# Altium schematic sheet UD3.1 N+P Gate Driver.SchDoc
size A3; DocumentNumber: 6; SheetNumber: 6; SheetTotal: 7
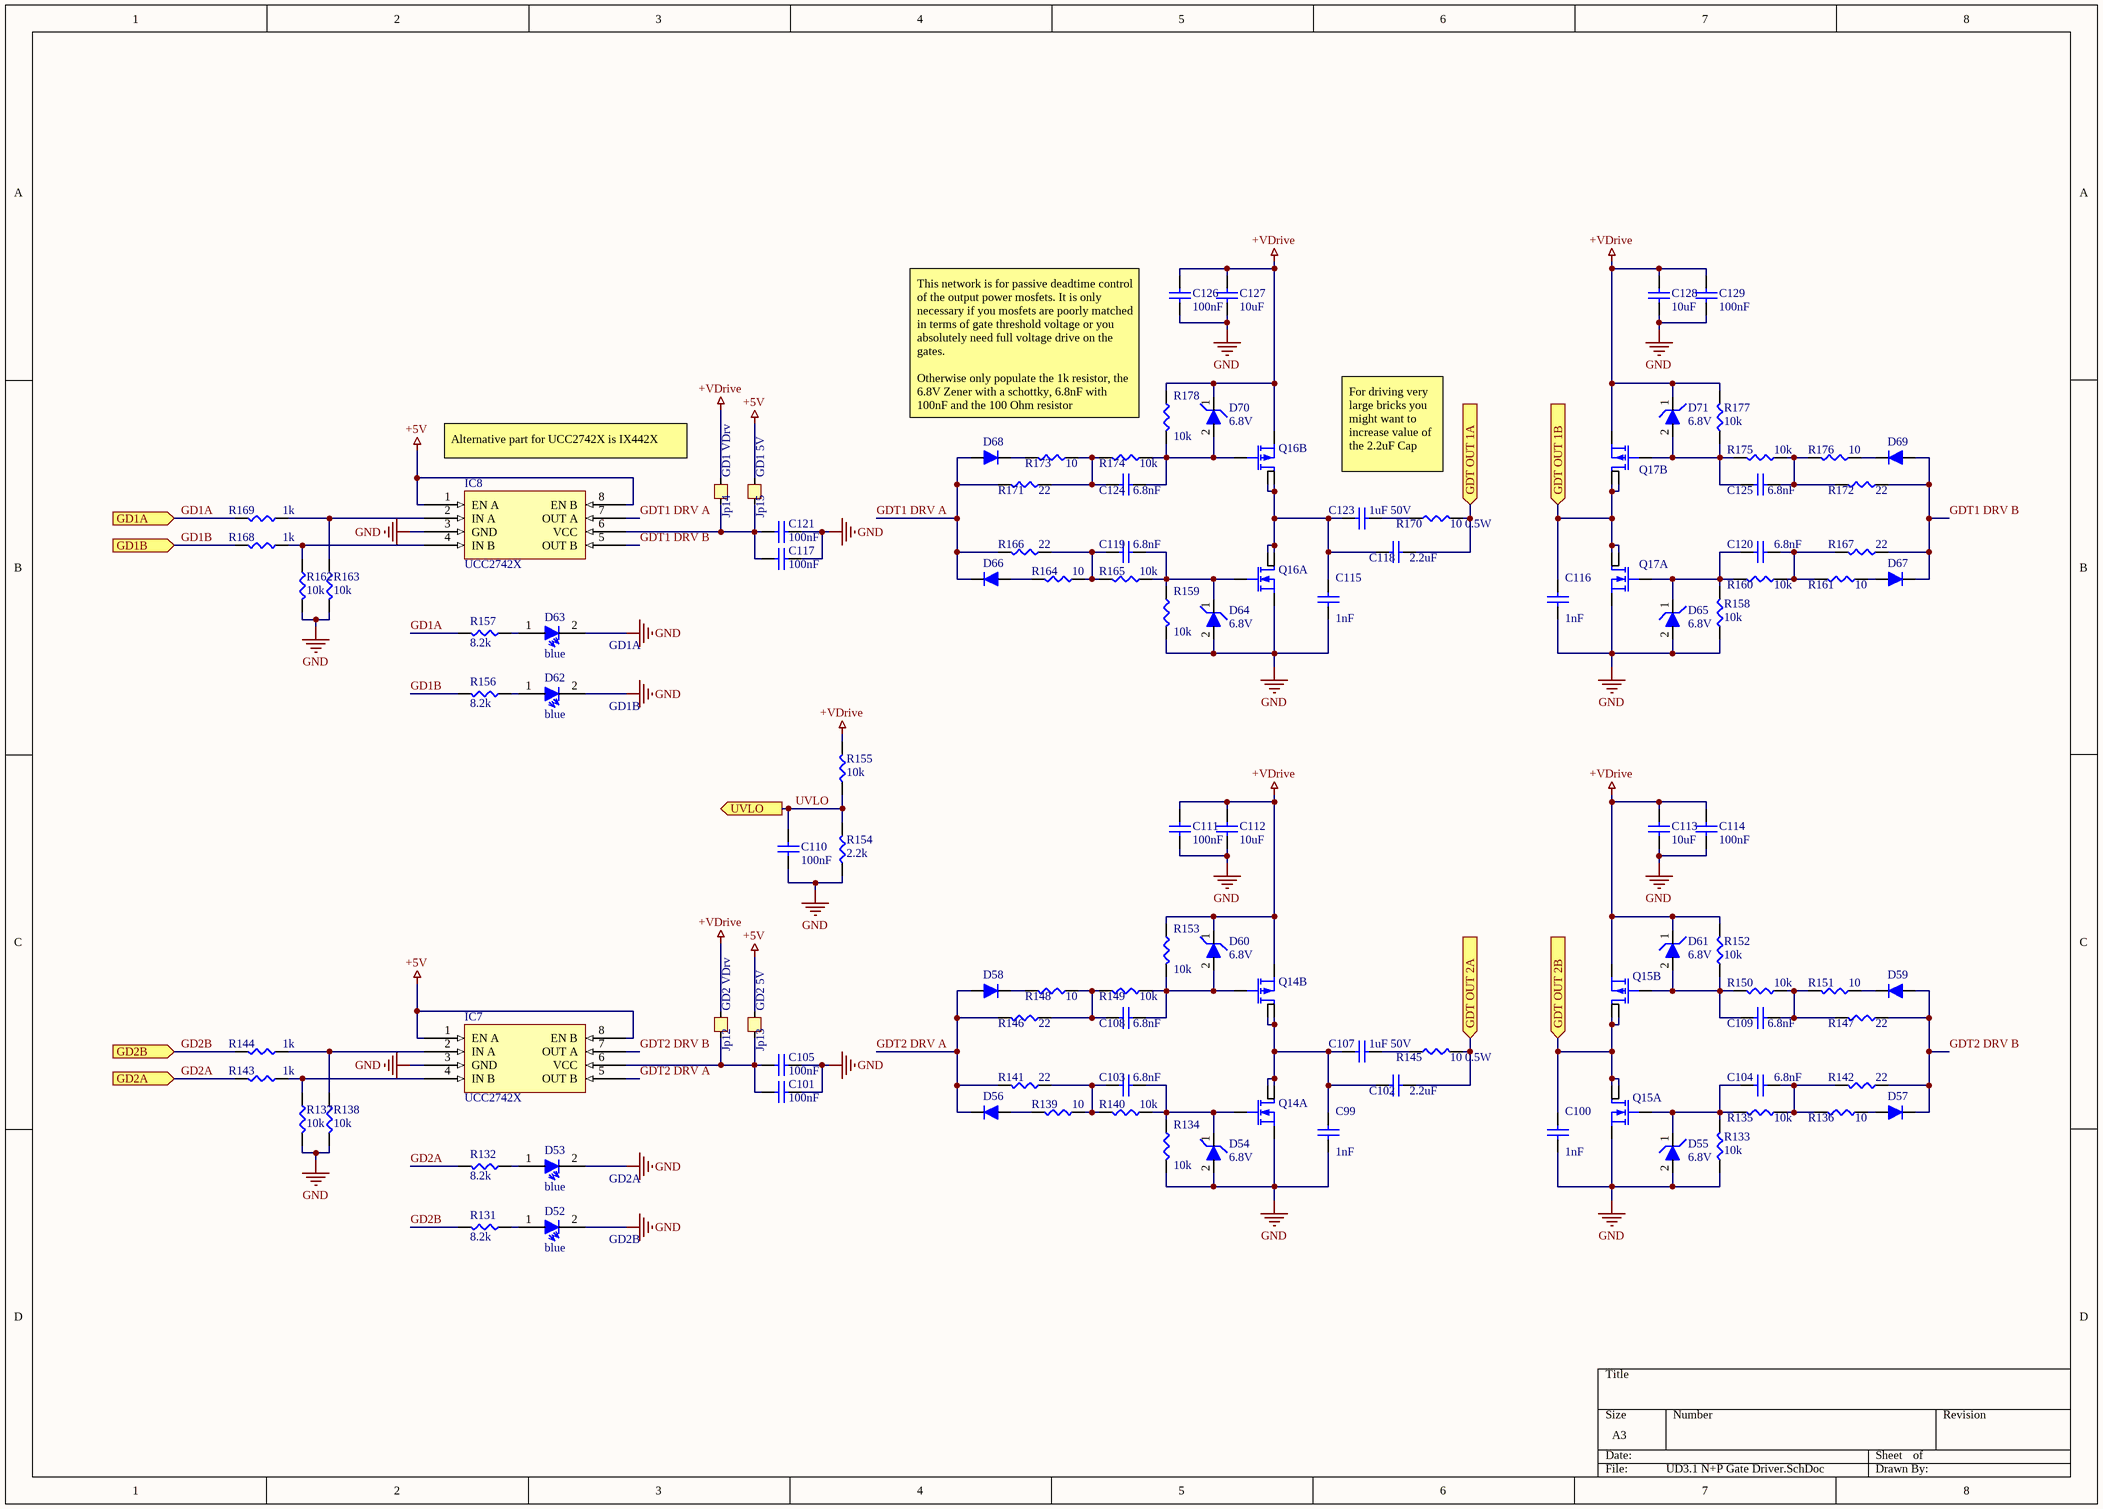
[diagram p0: UD3.1 N+P Gate Driver.SchDoc]

## Parts
C99  1nF  [0603]
C100  1nF  [0603]
C101  100nF  [0603]
C102  2.2uF  [1210]
C103  6.8nF  [0603]
C104  6.8nF  [0603]
C105  100nF  [0603]
C107  1uF 50V  [1210]
C108  6.8nF  [0603]
C109  6.8nF  [0603]
C110  100nF  [0603]
C111  100nF  [0603]
C112  10uF  [0805]
C113  10uF  [0805]
C114  100nF  [0603]
C115  1nF  [0603]
C116  1nF  [0603]
C117  100nF  [0603]
C118  2.2uF  [1210]
C119  6.8nF  [0603]
C120  6.8nF  [0603]
C121  100nF  [0603]
C123  1uF 50V  [1210]
C124  6.8nF  [0603]
C125  6.8nF  [0603]
C126  100nF  [0603]
C127  10uF  [0805]
C128  10uF  [0805]
C129  100nF  [0603]
D52  blue  [1206 Reverse Mount]
D53  blue  [1206 Reverse Mount]
D54  6.8V  [SOD523]
D55  6.8V  [SOD523]
D56  Schottky 30V 100mA  [SOD523]  (value not drawn)
D57  Schottky 30V 100mA  [SOD523]  (value not drawn)
D58  Schottky 30V 100mA  [SOD523]  (value not drawn)
D59  Schottky 30V 100mA  [SOD523]  (value not drawn)
D60  6.8V  [SOD523]
D61  6.8V  [SOD523]
D62  blue  [1206 Reverse Mount]
D63  blue  [1206 Reverse Mount]
D64  6.8V  [SOD523]
D65  6.8V  [SOD523]
D66  Schottky 30V 100mA  [SOD523]  (value not drawn)
D67  Schottky 30V 100mA  [SOD523]  (value not drawn)
D68  Schottky 30V 100mA  [SOD523]  (value not drawn)
D69  Schottky 30V 100mA  [SOD523]  (value not drawn)
D70  6.8V  [SOD523]
D71  6.8V  [SOD523]
IC7  UCC2742X  [SOIC8]
IC8  UCC2742X  [SOIC8]
Jp12  GD2 VDrv  [PCB Jumper NO]
Jp13  GD2 5V  [PCB Jumper NO]
Jp14  GD1 VDrv  [PCB Jumper NO]
Jp15  GD1 5V  [PCB Jumper NO]
Q14  Mosfet 1N1P  [SO-8FL - Dual]  (value not drawn)  (parts A,B of 2)
Q15  Mosfet 1N1P  [SO-8FL - Dual]  (value not drawn)  (parts A,B of 2)
Q16  Mosfet 1N1P  [SO-8FL - Dual]  (value not drawn)  (parts A,B of 2)
Q17  Mosfet 1N1P  [SO-8FL - Dual]  (value not drawn)  (parts A,B of 2)
R131  8.2k  [0603]
R132  8.2k  [0603]
R133  10k  [0603]
R134  10k  [0603]
R135  10k  [0603]
R136  10  [0603]
R137  10k  [0603]
R138  10k  [0603]
R139  10  [0603]
R140  10k  [0603]
R141  22  [0603]
R142  22  [0603]
R143  1k  [0603]
R144  1k  [0603]
R145  10 0.5W  [1210]
R146  22  [0603]
R147  22  [0603]
R148  10  [0603]
R149  10k  [0603]
R150  10k  [0603]
R151  10  [0603]
R152  10k  [0603]
R153  10k  [0603]
R154  2.2k  [0603]
R155  10k  [0603]
R156  8.2k  [0603]
R157  8.2k  [0603]
R158  10k  [0603]
R159  10k  [0603]
R160  10k  [0603]
R161  10  [0603]
R162  10k  [0603]
R163  10k  [0603]
R164  10  [0603]
R165  10k  [0603]
R166  22  [0603]
R167  22  [0603]
R168  1k  [0603]
R169  1k  [0603]
R170  10 0.5W  [1210]
R171  22  [0603]
R172  22  [0603]
R173  10  [0603]
R174  10k  [0603]
R175  10k  [0603]
R176  10  [0603]
R177  10k  [0603]
R178  10k  [0603]

## Ports
GD1A (in), GD1B (in), GD2A (in), GD2B (in), GDT OUT 1A (in), GDT OUT 1B (in), GDT OUT 2A (in), GDT OUT 2B (in), UVLO (out)

## Nets
+5V: IC7.1(EN_A) IC7.8(EN_B) IC8.1(EN_A) IC8.8(EN_B) Jp13.2 Jp15.2
+VDrive: C111.2 C112.2 C113.2 C114.2 C126.2 C127.2 C128.2 C129.2 D60.1 D61.1 D70.1 D71.1 Jp12.2 Jp14.2 Q14.Sp Q15.Sp Q16.Sp Q17.Sp R152.2 R153.2 R155.1 R177.2 R178.2
GND: C99.1 C100.1 C101.2 C105.2 C110.1 C111.1 C112.1 C113.1 C114.1 C115.1 C116.1 C117.2 C121.2 C126.1 C127.1 C128.1 C129.1 D52.2 D53.2 D54.2 D55.2 D62.2 D63.2 D64.2 D65.2 IC7.3(GND) IC8.3(GND) Q14.Sn Q15.Sn Q16.Sn Q17.Sn R133.1 R134.1 R137.1 R138.1 R154.2 R158.1 R159.1 R162.1 R163.1
GD1A: R157.1 R169.1 ; port GD1A
GD1B: R156.1 R168.1 ; port GD1B
GD2A: R132.1 R143.1 ; port GD2A
GD2B: R131.1 R144.1 ; port GD2B
GDT1 DRV A: D66.2 D68.1 IC8.7(OUT_A) R166.1 R171.1
GDT1 DRV B: D67.2 D69.1 IC8.5(OUT_B) R167.1 R172.1
GDT2 DRV A: D56.2 D58.1 IC7.5(OUT_B) R141.1 R146.1
GDT2 DRV B: D57.2 D59.1 IC7.7(OUT_A) R142.1 R147.1
GDT OUT 1A: C118.2 R170.2 ; port GDT OUT 1A
GDT OUT 1B: C116.2 Q17.Dn1 Q17.Dn2 Q17.Dp1 Q17.Dp2 ; port GDT OUT 1B
GDT OUT 2A: C102.2 R145.2 ; port GDT OUT 2A
GDT OUT 2B: C100.2 Q15.Dn1 Q15.Dn2 Q15.Dp1 Q15.Dp2 ; port GDT OUT 2B
UVLO: C110.2 R154.1 R155.2 ; port UVLO
NetC99_2: C99.2 C102.1 C107.1 Q14.Dn1 Q14.Dn2 Q14.Dp1 Q14.Dp2
NetC101_1: C101.1 C105.1 IC7.6(VCC) Jp12.1 Jp13.1
NetC103_1: C103.1 R139.2 R140.1 R141.2
NetC103_2: C103.2 D54.1 Q14.Gn R134.2 R140.2
NetC104_1: C104.1 R135.1 R136.2 R142.2
NetC104_2: C104.2 D55.1 Q15.Gn R133.2 R135.2
NetC107_2: C107.2 R145.1
NetC108_1: C108.1 R146.2 R148.2 R149.1
NetC108_2: C108.2 D60.2 Q14.Gp R149.2 R153.1
NetC109_1: C109.1 R147.2 R150.1 R151.2
NetC109_2: C109.2 D61.2 Q15.Gp R150.2 R152.1
NetC115_2: C115.2 C118.1 C123.1 Q16.Dn1 Q16.Dn2 Q16.Dp1 Q16.Dp2
NetC117_1: C117.1 C121.1 IC8.6(VCC) Jp14.1 Jp15.1
NetC119_1: C119.1 R164.2 R165.1 R166.2
NetC119_2: C119.2 D64.1 Q16.Gn R159.2 R165.2
NetC120_1: C120.1 R160.1 R161.2 R167.2
NetC120_2: C120.2 D65.1 Q17.Gn R158.2 R160.2
NetC123_2: C123.2 R170.1
NetC124_1: C124.1 R171.2 R173.2 R174.1
NetC124_2: C124.2 D70.2 Q16.Gp R174.2 R178.1
NetC125_1: C125.1 R172.2 R175.1 R176.2
NetC125_2: C125.2 D71.2 Q17.Gp R175.2 R177.1
NetD52_1: D52.1 R131.2
NetD53_1: D53.1 R132.2
NetD56_1: D56.1 R139.1
NetD57_1: D57.1 R136.1
NetD58_2: D58.2 R148.1
NetD59_2: D59.2 R151.1
NetD62_1: D62.1 R156.2
NetD63_1: D63.1 R157.2
NetD66_1: D66.1 R164.1
NetD67_1: D67.1 R161.1
NetD68_2: D68.2 R173.1
NetD69_2: D69.2 R176.1
NetIC7_2: IC7.2(IN_A) R138.2 R144.2
NetIC7_4: IC7.4(IN_B) R137.2 R143.2
NetIC8_2: IC8.2(IN_A) R163.2 R169.2
NetIC8_4: IC8.4(IN_B) R162.2 R168.2

## Notes on the sheet
- Alternative part for UCC2742X is IX442X
- This network is for passive deadtime control of the output power mosfets. It is only necessary if you mosfets are poorly matched in terms of gate threshold voltage or you absolutely need full voltage drive on the gates.
  Otherwise only populate the 1k resistor, the 6.8V Zener with a schottky, 6.8nF with 100nF and the 100 Ohm resistor
- For driving very large bricks you might want to increase value of the 2.2uF Cap
- (near D63) GD1A
- (near D62) GD1B
- (near D53) GD2A
- (near D52) GD2B

## Library data of the parts
C99-C105 C107-C121 C123-C129 = Cap
  C101 C103-C105 C108 C109 C117 C119-C121 C124 C125: Supplier 1: Digi-Key; Supplier 2: Digi-Key; Supplier 3: Digi-Key; Supplier Part Number 1: 1276-2044-1-ND; Supplier Part Number 2: 1276-1018-1-ND; Supplier Part Number 3: 1276-1182-1-ND; Supplier 4: Digi-Key; Supplier 5: Digi-Key; Supplier 6: Digi-Key; Supplier 7: Digi-Key; Supplier 8: Digi-Key; Supplier 9: Digi-Key; Supplier Part Number 4: 1276-1009-1-ND; Supplier Part Number 5: 1276-1098-1-ND; Supplier Part Number 6: 1276-1119-1-ND; Supplier Part Number 7: 490-12737-1-ND; Supplier Part Number 9: 587-1249-1-ND; Supplier Part Number 8: 1276-1183-1-ND; Supplier 10: Digi-Key; Supplier 11: Digi-Key; Supplier 12: Digi-Key; Supplier 13: Digi-Key; Supplier Part Number 10: 1276-CL10B104KB8NNNLCT-ND; Supplier Part Number 11: 399-1085-1-ND; Supplier Part Number 13: 587-2985-1-ND; Supplier Part Number 12: 1276-1021-1-ND; Supplier 14: Digi-Key; Supplier 15: Digi-Key; Supplier 16: Digi-Key; Supplier 17: Digi-Key; Supplier 18: Digi-Key; Supplier 19: Digi-Key; Supplier Part Number 14: 490-14603-1-ND; Supplier Part Number 15: 311-3700-1-ND; Supplier Part Number 16: 311-1042-1-ND; Supplier Part Number 17: 311-1415-1-ND; Supplier Part Number 19: 587-4321-1-ND; Supplier Part Number 18: 1276-1907-1-ND; Supplier 20: Digi-Key; Supplier 21: Digi-Key; Supplier 22: Digi-Key; Supplier Part Number 20: 1276-6767-1-ND; Supplier Part Number 21: 1276-7060-1-ND; Supplier Part Number 22: 311-1084-1-ND
D52 D53 D62 D63 = LED: Diode, but it lights up; Supplier 1: Digi-Key; Supplier 2: Digi-Key; Supplier 3: Digi-Key; Supplier 4: Digi-Key; Supplier Part Number 1: 732-4979-1-ND; Supplier Part Number 2: 732-4971-1-ND; Supplier Part Number 3: 732-4966-1-ND; Supplier Part Number 4: 732-4981-1-ND
D54 D55 D60 D61 D64 D65 D70 D71 = Diode Zener: Supplier 1: Digi-Key; Supplier Part Number 1: UCLAMP3301HCT-ND
D56-D59 D66-D69 = Diode: Cmon its a diode what more do I need to say?; pin to pad: 1>2 2>1; Supplier 1: Digi-Key; Supplier Part Number 1: MBR10100GOS-ND; Supplier 2: Digi-Key; Supplier Part Number 2: 1655-1504-1-ND
IC7 IC8 = UCC2742X: Dual gate driver
Jp12-Jp15 = Jumper
Q14-Q17 = Mosfet 1N1P: Dual Mosfet, one N & P channel resp.; pin to pad: Dn1>7/8 Dn2>7/8 Dp1>5/6 Dp2>5/6 Gn>2 Gp>4 Sn>1 Sp>3; Supplier 1: Digi-Key
R131-R178 = Resistor